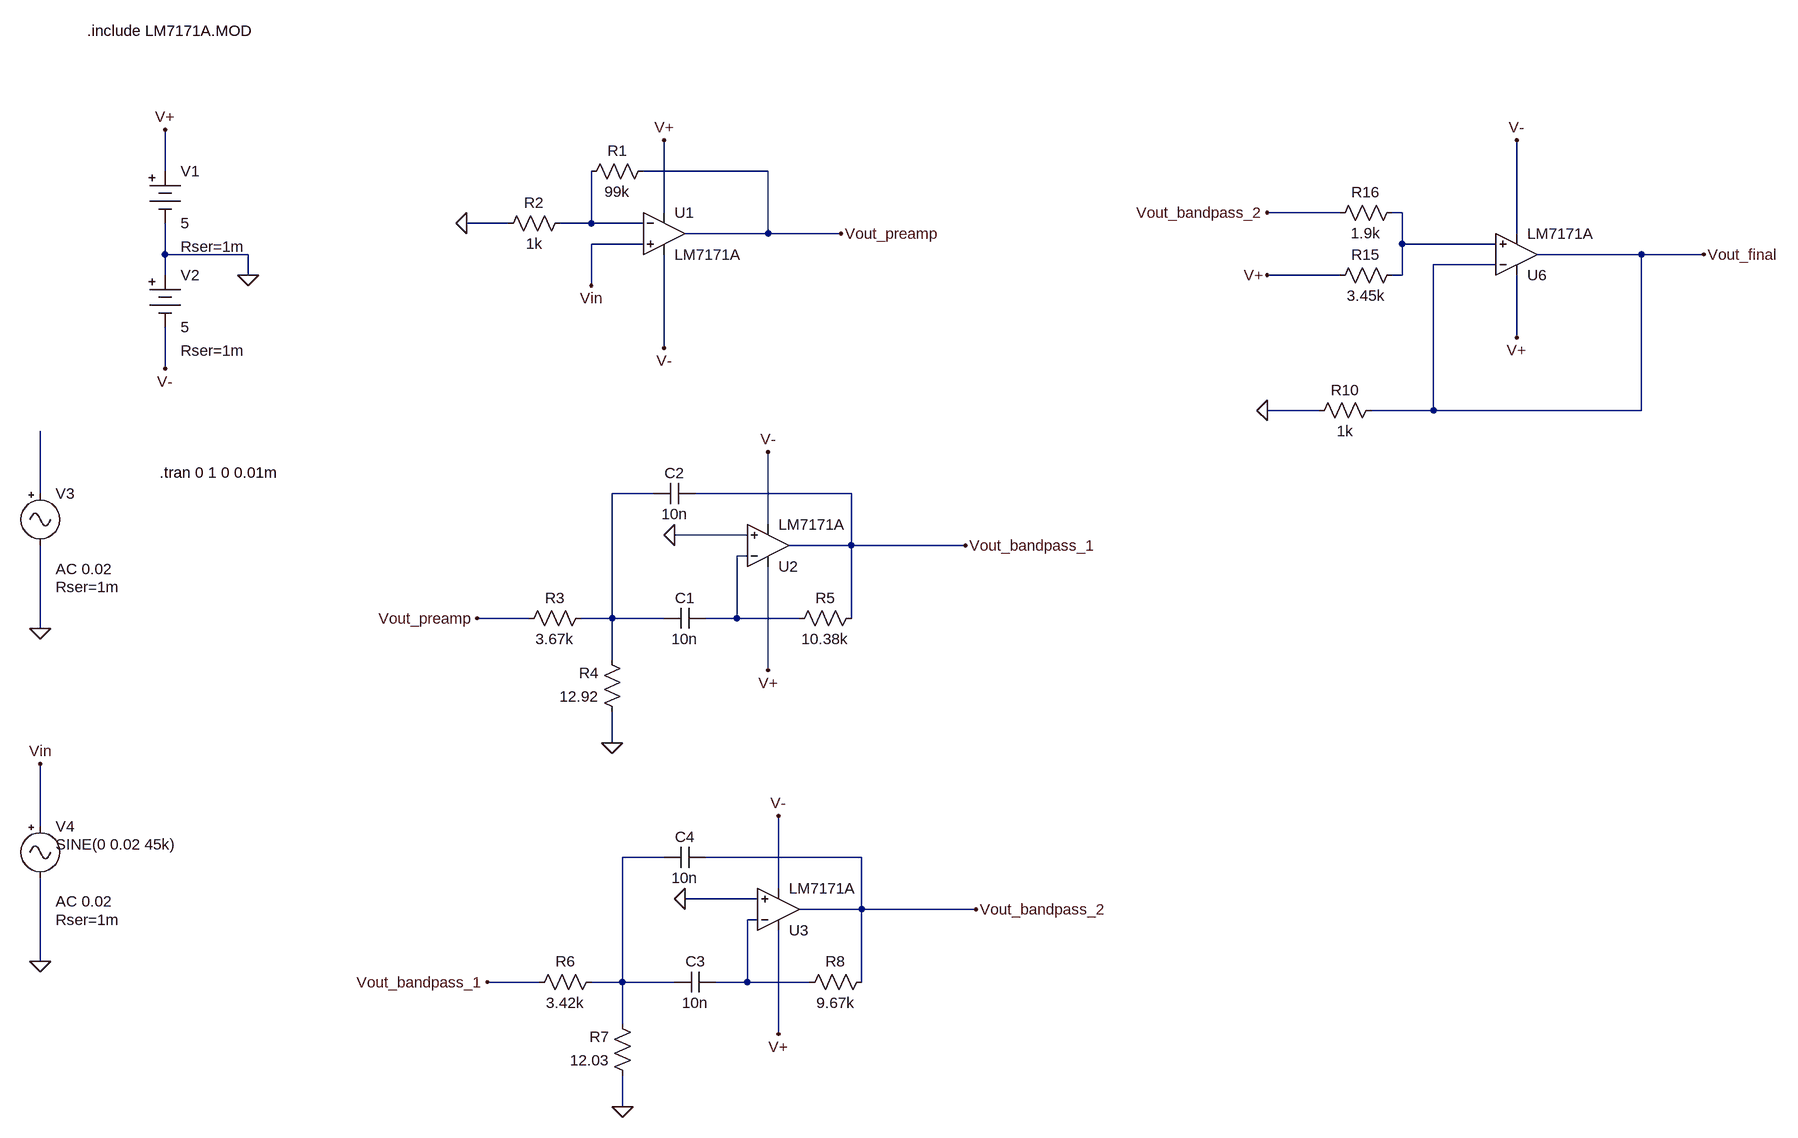
[diagram p0: schematic hydrophones.asc]
hydrophones.asc, the LTspice schematic file:
Version 4
SHEET 1 2992 2868
WIRE -720 80 -720 16
WIRE 208 80 16 80
WIRE 48 144 48 32
WIRE 1088 144 976 144
WIRE 1184 144 1168 144
WIRE -192 160 -256 160
WIRE -64 160 -64 80
WIRE -64 160 -112 160
WIRE 16 160 -64 160
WIRE 208 176 208 80
WIRE 208 176 80 176
WIRE 320 176 208 176
WIRE 1360 176 1360 32
WIRE 16 192 -64 192
WIRE 1184 192 1184 144
WIRE 1328 192 1184 192
WIRE -720 208 -720 160
WIRE -592 208 -720 208
WIRE 1552 208 1392 208
WIRE 1648 208 1552 208
WIRE 1328 224 1232 224
WIRE -720 240 -720 208
WIRE -592 240 -592 208
WIRE 1088 240 976 240
WIRE 1184 240 1184 192
WIRE 1184 240 1168 240
WIRE -64 256 -64 192
WIRE 1360 336 1360 240
WIRE 48 352 48 208
WIRE -720 384 -720 320
WIRE 1056 448 976 448
WIRE 1232 448 1232 224
WIRE 1232 448 1136 448
WIRE 1552 448 1552 208
WIRE 1552 448 1232 448
WIRE -912 576 -912 480
WIRE 32 576 -32 576
WIRE 336 576 96 576
WIRE 208 624 208 512
WIRE 176 640 64 640
WIRE 336 656 336 576
WIRE 336 656 240 656
WIRE 512 656 336 656
WIRE 176 672 160 672
WIRE -160 768 -240 768
WIRE -32 768 -32 576
WIRE -32 768 -80 768
WIRE 48 768 -32 768
WIRE 160 768 160 672
WIRE 160 768 112 768
WIRE 256 768 160 768
WIRE 336 768 336 656
WIRE -912 784 -912 656
WIRE -32 832 -32 768
WIRE 208 848 208 688
WIRE -32 960 -32 912
WIRE -912 1088 -912 992
WIRE 48 1136 -16 1136
WIRE 352 1136 112 1136
WIRE 224 1184 224 1072
WIRE 192 1200 80 1200
WIRE 352 1216 352 1136
WIRE 352 1216 256 1216
WIRE 528 1216 352 1216
WIRE 192 1232 176 1232
WIRE -912 1296 -912 1168
WIRE -144 1328 -224 1328
WIRE -16 1328 -16 1136
WIRE -16 1328 -64 1328
WIRE 64 1328 -16 1328
WIRE 176 1328 176 1232
WIRE 176 1328 128 1328
WIRE 272 1328 176 1328
WIRE 352 1328 352 1216
WIRE -16 1392 -16 1328
WIRE 224 1408 224 1248
WIRE -16 1520 -16 1472
FLAG -720 16 V+
FLAG -592 240 0
FLAG -720 384 V-
FLAG 48 32 V+
FLAG 48 352 V-
FLAG -256 160 0
FLAG -64 256 Vin
FLAG -912 784 0
FLAG 320 176 Vout_preamp
FLAG 208 848 V+
FLAG 208 512 V-
FLAG 64 640 0
FLAG -240 768 Vout_preamp
FLAG -32 960 0
FLAG 512 656 Vout_bandpass_1
FLAG 224 1408 V+
FLAG 224 1072 V-
FLAG 80 1200 0
FLAG -16 1520 0
FLAG 528 1216 Vout_bandpass_2
FLAG -224 1328 Vout_bandpass_1
FLAG -912 1296 0
FLAG -912 992 Vin
FLAG 1360 32 V-
FLAG 1360 336 V+
FLAG 976 240 V+
FLAG 976 144 Vout_bandpass_2
FLAG 1648 208 Vout_final
FLAG 976 448 0
SYMBOL Opamps\\opamp2 48 112 R0
SYMATTR InstName U1
SYMATTR Value LM7171A
SYMBOL Misc\\battery -720 64 R0
WINDOW 123 0 0 Left 0
WINDOW 39 24 132 Left 2
SYMATTR SpiceLine Rser=1m
SYMATTR InstName V1
SYMATTR Value 5
SYMBOL Misc\\battery -720 224 R0
WINDOW 123 0 0 Left 0
WINDOW 39 24 132 Left 2
SYMATTR SpiceLine Rser=1m
SYMATTR InstName V2
SYMATTR Value 5
SYMBOL res 32 64 R90
WINDOW 0 0 56 VBottom 2
WINDOW 3 32 56 VTop 2
SYMATTR InstName R1
SYMATTR Value 99k
SYMATTR SpiceLine tol=1 pwr=0.25
SYMBOL res -96 144 R90
WINDOW 0 0 56 VBottom 2
WINDOW 3 32 56 VTop 2
SYMATTR InstName R2
SYMATTR Value 1k
SYMATTR SpiceLine tol=1 pwr=0.25
SYMBOL Misc\\signal -912 560 R0
WINDOW 123 24 132 Left 2
WINDOW 39 24 160 Left 2
SYMATTR Value2 AC 0.02
SYMATTR SpiceLine Rser=1m
SYMATTR InstName V3
SYMATTR Value ""
SYMBOL Opamps\\opamp2 208 720 M180
SYMATTR InstName U2
SYMATTR Value LM7171A
SYMBOL res -64 752 R90
WINDOW 0 0 56 VBottom 2
WINDOW 3 32 56 VTop 2
SYMATTR InstName R3
SYMATTR Value 3.67k
SYMATTR SpiceLine tol=1 pwr=0.25
SYMBOL res -16 928 R180
WINDOW 0 36 76 Left 2
WINDOW 3 36 40 Left 2
SYMATTR InstName R4
SYMATTR Value 12.92
SYMATTR SpiceLine tol=1 pwr=0.25
SYMBOL cap 112 752 R90
WINDOW 0 0 32 VBottom 2
WINDOW 3 32 32 VTop 2
SYMATTR InstName C1
SYMATTR Value 10n
SYMBOL cap 96 560 R90
WINDOW 0 0 32 VBottom 2
WINDOW 3 32 32 VTop 2
SYMATTR InstName C2
SYMATTR Value 10n
SYMBOL res 352 752 R90
WINDOW 0 0 56 VBottom 2
WINDOW 3 32 56 VTop 2
SYMATTR InstName R5
SYMATTR Value 10.38k
SYMATTR SpiceLine tol=1 pwr=0.25
SYMBOL Opamps\\opamp2 224 1280 M180
SYMATTR InstName U3
SYMATTR Value LM7171A
SYMBOL res -48 1312 R90
WINDOW 0 0 56 VBottom 2
WINDOW 3 32 56 VTop 2
SYMATTR InstName R6
SYMATTR Value 3.42k
SYMATTR SpiceLine tol=1 pwr=0.25
SYMBOL res 0 1488 R180
WINDOW 0 36 76 Left 2
WINDOW 3 36 40 Left 2
SYMATTR InstName R7
SYMATTR Value 12.03
SYMATTR SpiceLine tol=1 pwr=0.25
SYMBOL cap 128 1312 R90
WINDOW 0 0 32 VBottom 2
WINDOW 3 32 32 VTop 2
SYMATTR InstName C3
SYMATTR Value 10n
SYMBOL cap 112 1120 R90
WINDOW 0 0 32 VBottom 2
WINDOW 3 32 32 VTop 2
SYMATTR InstName C4
SYMATTR Value 10n
SYMBOL res 368 1312 R90
WINDOW 0 0 56 VBottom 2
WINDOW 3 32 56 VTop 2
SYMATTR InstName R8
SYMATTR Value 9.67k
SYMATTR SpiceLine tol=1 pwr=0.25
SYMBOL Misc\\signal -912 1072 R0
WINDOW 123 24 132 Left 2
WINDOW 39 24 160 Left 2
WINDOW 3 24 44 Left 2
SYMATTR Value2 AC 0.02
SYMATTR SpiceLine Rser=1m
SYMATTR Value SINE(0 0.02 45k)
SYMATTR InstName V4
SYMBOL Opamps\\opamp2 1360 272 M180
SYMATTR InstName U6
SYMATTR Value LM7171A
SYMBOL res 1184 224 R90
WINDOW 0 0 56 VBottom 2
WINDOW 3 32 56 VTop 2
SYMATTR InstName R15
SYMATTR Value 3.45k
SYMATTR SpiceLine tol=1 pwr=0.25
SYMBOL res 1184 128 R90
WINDOW 0 0 56 VBottom 2
WINDOW 3 32 56 VTop 2
SYMATTR InstName R16
SYMATTR Value 1.9k
SYMATTR SpiceLine tol=1 pwr=0.25
SYMBOL res 1152 432 R90
WINDOW 0 0 56 VBottom 2
WINDOW 3 32 56 VTop 2
SYMATTR InstName R10
SYMATTR Value 1k
SYMATTR SpiceLine tol=1 pwr=0.25
TEXT -840 -136 Left 2 !.include LM7171A.MOD
TEXT -728 544 Left 2 !.tran 0 1 0 0.01m

The netlist it stands for:
* hydrophones.asc
XU1 Vin N002 V+ V- Vout_preamp LM7171A  ; pins In+ In- V+ V- OUT
V1 V+ 0 5 Rser=1m
V2 0 V- 5 Rser=1m
R1 Vout_preamp N002 99k tol=1 pwr=0.25
R2 N002 0 1k tol=1 pwr=0.25
V3 N003 0 AC 0.02 Rser=1m
XU2 0 N005 V+ V- Vout_bandpass_1 LM7171A  ; pins In+ In- V+ V- OUT
R3 N004 Vout_preamp 3.67k tol=1 pwr=0.25
R4 0 N004 12.92 tol=1 pwr=0.25
C1 N005 N004 10n
C2 Vout_bandpass_1 N004 10n
R5 Vout_bandpass_1 N005 10.38k tol=1 pwr=0.25
XU3 0 N007 V+ V- Vout_bandpass_2 LM7171A  ; pins In+ In- V+ V- OUT
R6 N006 Vout_bandpass_1 3.42k tol=1 pwr=0.25
R7 0 N006 12.03 tol=1 pwr=0.25
C3 N007 N006 10n
C4 Vout_bandpass_2 N006 10n
R8 Vout_bandpass_2 N007 9.67k tol=1 pwr=0.25
V4 Vin 0 SINE(0 0.02 45k) AC 0.02 Rser=1m
XU6 N001 Vout_final V+ V- Vout_final LM7171A  ; pins In+ In- V+ V- OUT
R15 N001 V+ 3.45k tol=1 pwr=0.25
R16 N001 Vout_bandpass_2 1.9k tol=1 pwr=0.25
R10 Vout_final 0 1k tol=1 pwr=0.25
.include LM7171A.MOD
.tran 0 1 0 0.01m
.backanno
.end